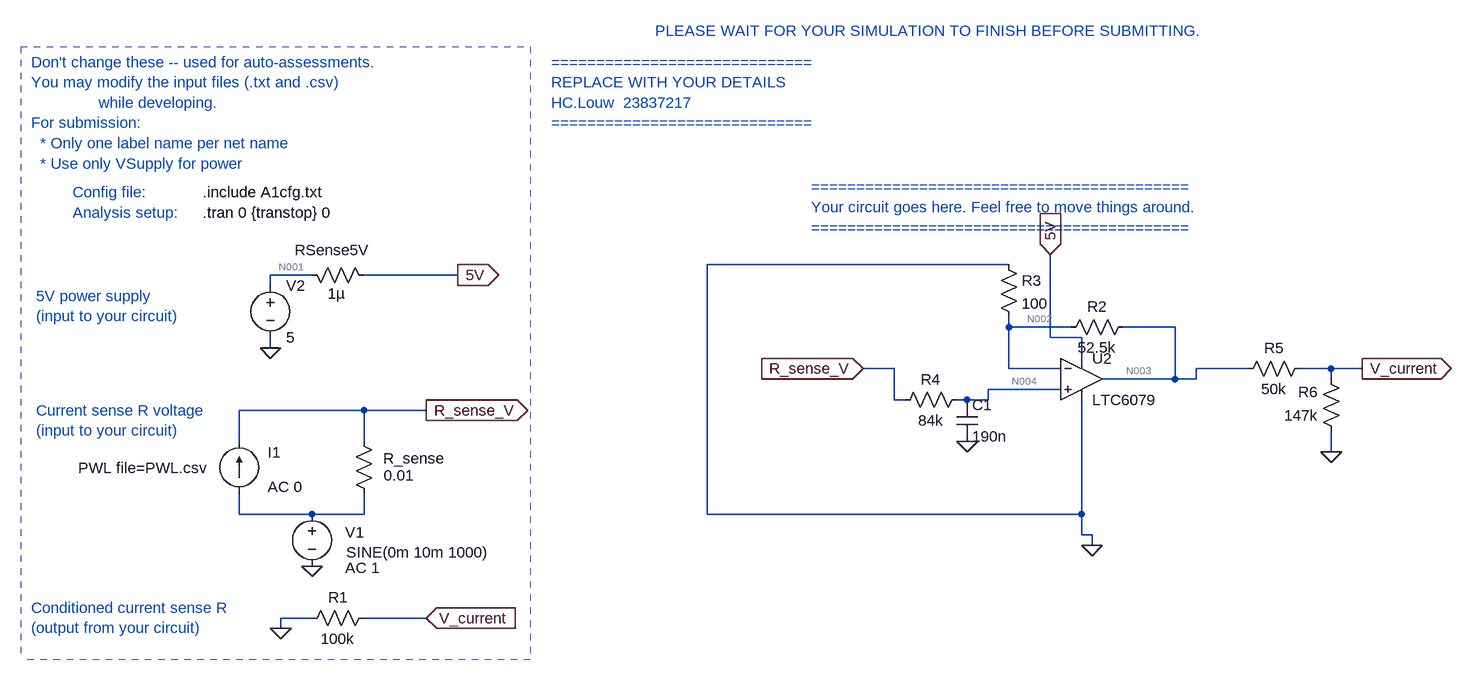
[diagram p0: schematic E344_Ass1_CurrSense.asc]
E344_Ass1_CurrSense.asc, the LTspice schematic file:
Version 4
SHEET 1 3140 2124
WIRE -848 -1088 -1312 -1088
WIRE -1920 -1072 -1984 -1072
WIRE -1696 -1072 -1840 -1072
WIRE -1984 -1056 -1984 -1072
WIRE -848 -992 -848 -1008
WIRE -752 -992 -848 -992
WIRE -592 -992 -672 -992
WIRE -784 -976 -784 -1104
WIRE -736 -976 -784 -976
WIRE -1984 -960 -1984 -976
WIRE -736 -944 -736 -976
WIRE -1024 -928 -1072 -928
WIRE -848 -928 -848 -992
WIRE -768 -928 -848 -928
WIRE -480 -928 -560 -928
WIRE -352 -928 -400 -928
WIRE -304 -928 -352 -928
WIRE -592 -912 -592 -992
WIRE -592 -912 -704 -912
WIRE -560 -912 -560 -928
WIRE -560 -912 -592 -912
WIRE -352 -912 -352 -928
WIRE -768 -896 -880 -896
WIRE -1024 -880 -1024 -928
WIRE -1008 -880 -1024 -880
WIRE -912 -880 -928 -880
WIRE -880 -880 -880 -896
WIRE -880 -880 -912 -880
WIRE -1840 -864 -2032 -864
WIRE -1744 -864 -1840 -864
WIRE -2032 -816 -2032 -864
WIRE -1840 -816 -1840 -864
WIRE -352 -800 -352 -832
WIRE -2032 -704 -2032 -736
WIRE -1920 -704 -2032 -704
WIRE -1840 -704 -1840 -736
WIRE -1840 -704 -1920 -704
WIRE -1312 -704 -1312 -1088
WIRE -736 -704 -736 -880
WIRE -736 -704 -1312 -704
WIRE -736 -672 -736 -704
WIRE -720 -672 -736 -672
WIRE -720 -656 -720 -672
WIRE -1920 -544 -1968 -544
WIRE -1744 -544 -1840 -544
WIRE -1968 -528 -1968 -544
FLAG -1696 -1072 5V
IOPIN -1696 -1072 Out
FLAG -1984 -960 0
FLAG -784 -1104 5V
IOPIN -784 -1104 In
FLAG -1744 -864 R_sense_V
IOPIN -1744 -864 Out
FLAG -1920 -624 0
FLAG -304 -928 V_current
IOPIN -304 -928 Out
FLAG -1072 -928 R_sense_V
IOPIN -1072 -928 In
FLAG -1744 -544 V_current
IOPIN -1744 -544 In
FLAG -1968 -528 0
FLAG -720 -656 0
FLAG -912 -816 0
FLAG -352 -800 0
SYMBOL voltage -1984 -1072 R0
WINDOW 123 0 0 Left 0
WINDOW 39 0 0 Left 0
SYMATTR InstName V2
SYMATTR Value 5
SYMBOL res -1936 -1088 M90
WINDOW 0 -7 47 VBottom 2
WINDOW 3 29 54 VTop 2
SYMATTR InstName RSense5V
SYMATTR Value 1µ
SYMBOL res -1824 -720 R180
WINDOW 0 -109 70 Left 2
WINDOW 3 -62 44 Left 2
SYMATTR InstName R_sense
SYMATTR Value 0.01
SYMBOL current -2032 -736 R180
WINDOW 0 -64 63 Left 2
WINDOW 3 248 39 Right 2
WINDOW 123 -97 10 Left 2
WINDOW 39 0 0 Left 0
SYMATTR InstName I1
SYMATTR Value PWL file=PWL.csv
SYMATTR Value2 AC 0
SYMBOL voltage -1920 -720 R0
WINDOW 0 66 60 Bottom 2
WINDOW 3 163 59 Top 2
WINDOW 123 78 114 Bottom 2
WINDOW 39 0 0 Left 0
SYMATTR InstName V1
SYMATTR Value SINE(0m 10m 1000)
SYMATTR Value2 AC 1
SYMBOL res -1824 -560 R90
WINDOW 0 0 56 VBottom 2
WINDOW 3 32 56 VTop 2
SYMATTR InstName R1
SYMATTR Value 100k
SYMBOL OpAmps\\LTC6079 -736 -912 R0
SYMATTR InstName U2
SYMBOL res -656 -1008 R90
WINDOW 0 0 56 VBottom 2
WINDOW 3 32 56 VTop 2
SYMATTR InstName R2
SYMATTR Value 52.5k
SYMBOL res -864 -1104 R0
SYMATTR InstName R3
SYMATTR Value 100
SYMBOL cap -928 -880 R0
SYMATTR InstName C1
SYMATTR Value 190n
SYMBOL res -912 -896 R90
WINDOW 0 0 56 VBottom 2
WINDOW 3 32 56 VTop 2
SYMATTR InstName R4
SYMATTR Value 84k
SYMBOL res -384 -944 R90
WINDOW 0 0 56 VBottom 2
WINDOW 3 32 56 VTop 2
SYMATTR InstName R5
SYMATTR Value 50k
SYMBOL res -336 -816 R180
WINDOW 0 36 76 Left 2
WINDOW 3 36 40 Left 2
SYMATTR InstName R6
SYMATTR Value 147k
TEXT -2088 -1168 Left 2 !.tran 0 {transtop} 0
TEXT -2088 -1200 Left 2 !.include A1cfg.txt
TEXT -2352 -1400 Left 2 ;Don't change these -- used for auto-assessments.\nYou may modify the input files (.txt and .csv) \n               while developing.\nFor submission: \n  * Only one label name per net name\n  * Use only VSupply for power
TEXT -2288 -1200 Left 2 ;Config file:
TEXT -2288 -1168 Left 2 ;Analysis setup:
TEXT -1552 -1400 Left 2 ;=============================\nREPLACE WITH YOUR DETAILS\nHC.Louw  23837217\n=============================
TEXT -1152 -1208 Left 2 ;==========================================\nYour circuit goes here. Feel free to move things around. \n==========================================
TEXT -1392 -1448 Left 2 ;PLEASE WAIT FOR YOUR SIMULATION TO FINISH BEFORE SUBMITTING.
TEXT -2344 -1040 Left 2 ;5V power supply\n(input to your circuit)
TEXT -2344 -864 Left 2 ;Current sense R voltage\n(input to your circuit)
TEXT -2352 -560 Left 2 ;Conditioned current sense R\n(output from your circuit)
LINE Normal -1584 -1424 -1584 -480 2
LINE Normal -2368 -1424 -1584 -1424 2
LINE Normal -1584 -480 -2368 -480 2
LINE Normal -1584 -496 -1584 -496 2
LINE Normal -2368 -1424 -2368 -480 2

The netlist it stands for:
* E344_Ass1_CurrSense.asc
V2 N001 0 5
RSense5V N001 5V 1µ
R_sense N005 R_sense_V 0.01
I1 N005 R_sense_V PWL file=PWL.csv AC 0
V1 N005 0 SINE(0m 10m 1000) AC 1
R1 V_current 0 100k
XU2 N004 N002 5V 0 N003 LTC6078  ; LTC6079, pins In+ In- V+ V- OUT
R2 N003 N002 52.5k
R3 0 N002 100
C1 N004 0 190n
R4 N004 R_sense_V 84k
R5 V_current N003 50k
R6 0 V_current 147k
.tran 0 {transtop} 0
.include A1cfg.txt
* Don't change these -- used for auto-assessments.
* You may modify the input files (.txt and .csv)
*                while developing.
* For submission:
*   * Only one label name per net name
*   * Use only VSupply for power
* Config file:
* Analysis setup:
* =============================
* REPLACE WITH YOUR DETAILS
* HC.Louw  23837217
* =============================
* ==========================================
* Your circuit goes here. Feel free to move things around.
* ==========================================
* PLEASE WAIT FOR YOUR SIMULATION TO FINISH BEFORE SUBMITTING.
* 5V power supply
* (input to your circuit)
* Current sense R voltage
* (input to your circuit)
* Conditioned current sense R
* (output from your circuit)
.lib LTC5.lib
.backanno
.end

* Results of the author's LTspice run, read from the files saved beside the schematic
* Operating Point, zero values left out:
*   V(n001) = 5 V
*   V(5v) = 5 V
*   V(v_current) = 394 µV
*   V(n004) = 143.6 nV
*   V(n002) = 1.378 µV
*   V(n003) = 724.9 µV
*   I(R6) = -2.68 nA
*   I(R5) = -6.62 nA
*   I(R4) = 1.71 pA
*   I(R3) = -13.78 nA
*   I(R2) = 13.78 nA
*   I(R1) = 3.94 nA
*   I(R_sense) = -1.71 pA
*   I(Rsense5v) = 36.71 µA
*   I(V1) = 1.71 pA
*   I(V2) = -36.71 µA
*   Ix(u2:1) = -1.71 pA
*   Ix(u2:2) = -1.71 pA
*   Ix(u2:3) = 36.71 µA
*   Ix(u2:4) = -36.69 µA
*   Ix(u2:5) = -20.4 nA
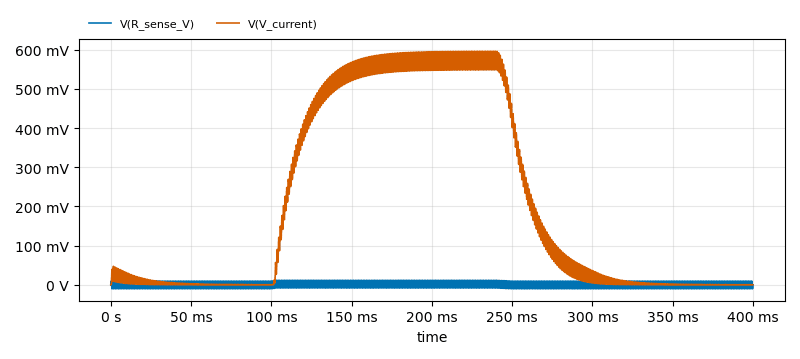
[diagram p1: Transient Analysis of E344_Ass1_CurrSense.asc, plotted from the saved traces]
* Transient Analysis, 1 run:
*   V(R_sense_V): min -9.976 mV, max 11.98 mV, average 714 µV, rms 7.118 mV, last 0 V
*   V(V_current): min 135.7 µV, max 595.8 mV, average 206.2 mV, rms 322.8 mV, last 253.4 µV